# Altium schematic sheet Sheet_1_2025-06-27.schdoc
size 208 x 85 mm
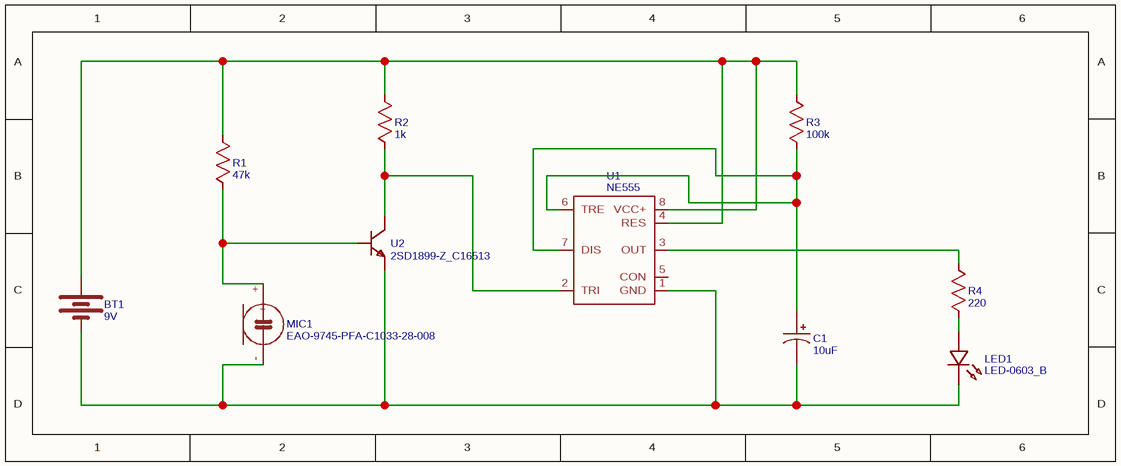
[diagram p0: Sheet_1_2025-06-27.schdoc]

## Parts
BT1  9V  [BAT-TH_2P-9VBATTERY]
C1  10uF  [CAPPR5-5X11]
LED1  LED-0603_B  [LED-SEG-TH_2P-L10.0-W10.0-LED1010]
MIC1  EAO-9745-PFA-C1033-28-008  [MIC2-D9.7XH4.5MM]
R1  47k  [R_AXIAL-0.3]
R2  1k  [R_AXIAL-0.3]
R3  100k  [R_AXIAL-0.3]
R4  220  [R_AXIAL-0.3]
U1  NE555  [DIP08-KIT]
U2  2SD1899-Z_C16513  [TO-251_L6.5-W2.3-P2.30-L]

## Nets
NetBT1_1: BT1.1(+) R1.2 R2.2 R3.2 U1.4(RES) U1.8(VCC+)
NetBT1_2: BT1.2(-) C1.2 LED1.2 MIC1.- U1.1(GND) U2.3(E)
NetC1_1: C1.1 R3.1 U1.6(TRE) U1.7(DIS)
NetLED1_1: LED1.1 R4.1
NetMIC1_+: MIC1.+ R1.1 U2.1(B)
NetR2_1: R2.1 U1.2(TRI) U2.2(C)
NetR4_2: R4.2 U1.3(OUT)

Not connected (* = marked no-connect by the designer): U1 5(CON)

## Library data of the parts
BT1 = 9V: Manufacturer: Q&J; Manufacturer Part: 9V电池铜线扣 铜100mm; Contributor: lcsc; Supplier: LCSC; Supplier Part: C70374; JLCPCB Part Class: Extended Part; spicePre: B; spiceSymbolName: 9V电池铜线扣 铜100MM
C1 = 10uF: nameAlias: Value(F); Contributor: LCEDA_Lib; spicePre: C; spiceSymbolName: CE_SMD_D4.0×H5.5_US
LED1 = LED-0603_B: Manufacturer: EVERLIGHT(台湾亿光); Manufacturer Part: 19-217/BHC-ZL1M2RY/3T; Contributor: LCEDA_01; Supplier Part: C72041; Supplier: LCSC; spicePre: L; spiceSymbolName: LED-0603_B
MIC1 = EAO-9745-PFA-C1033-28-008: description: Mini Microphone; Manufacturer Part: EAO-9745-PFA-C1033-28-008; spicePre: M; spiceSymbolName: EAO-9745-PFA-C1033-28-008
R1 = 47k: nameAlias: Value(Ω); Contributor: LCEDA_Lib; spicePre: R; spiceSymbolName: R_AXIAL-0.3_US
R2 = 1k: nameAlias: Value(Ω); Contributor: LCEDA_Lib; spicePre: R; spiceSymbolName: R_AXIAL-0.3_US
R3 = 100k: nameAlias: Value(Ω); Contributor: LCEDA_Lib; spicePre: R; spiceSymbolName: R_AXIAL-0.3_US
R4 = 220: nameAlias: Value(Ω); Contributor: LCEDA_Lib; spicePre: R; spiceSymbolName: R_AXIAL-0.3_US
U1 = NE555: Contributor: SparkFun; spicePre: U; spiceSymbolName: NE555
U2 = 2SD1899-Z_C16513: Manufacturer: CJ; Contributor: LCSC; Supplier: LCSC; Manufacturer Part: 2SD1899-Z; Supplier Part: C16513; spicePre: U; spiceSymbolName: 2SD1899-Z_C16513